# EAGLE design controllo motori - encoder_r3 (EAGLE 6.5.0)
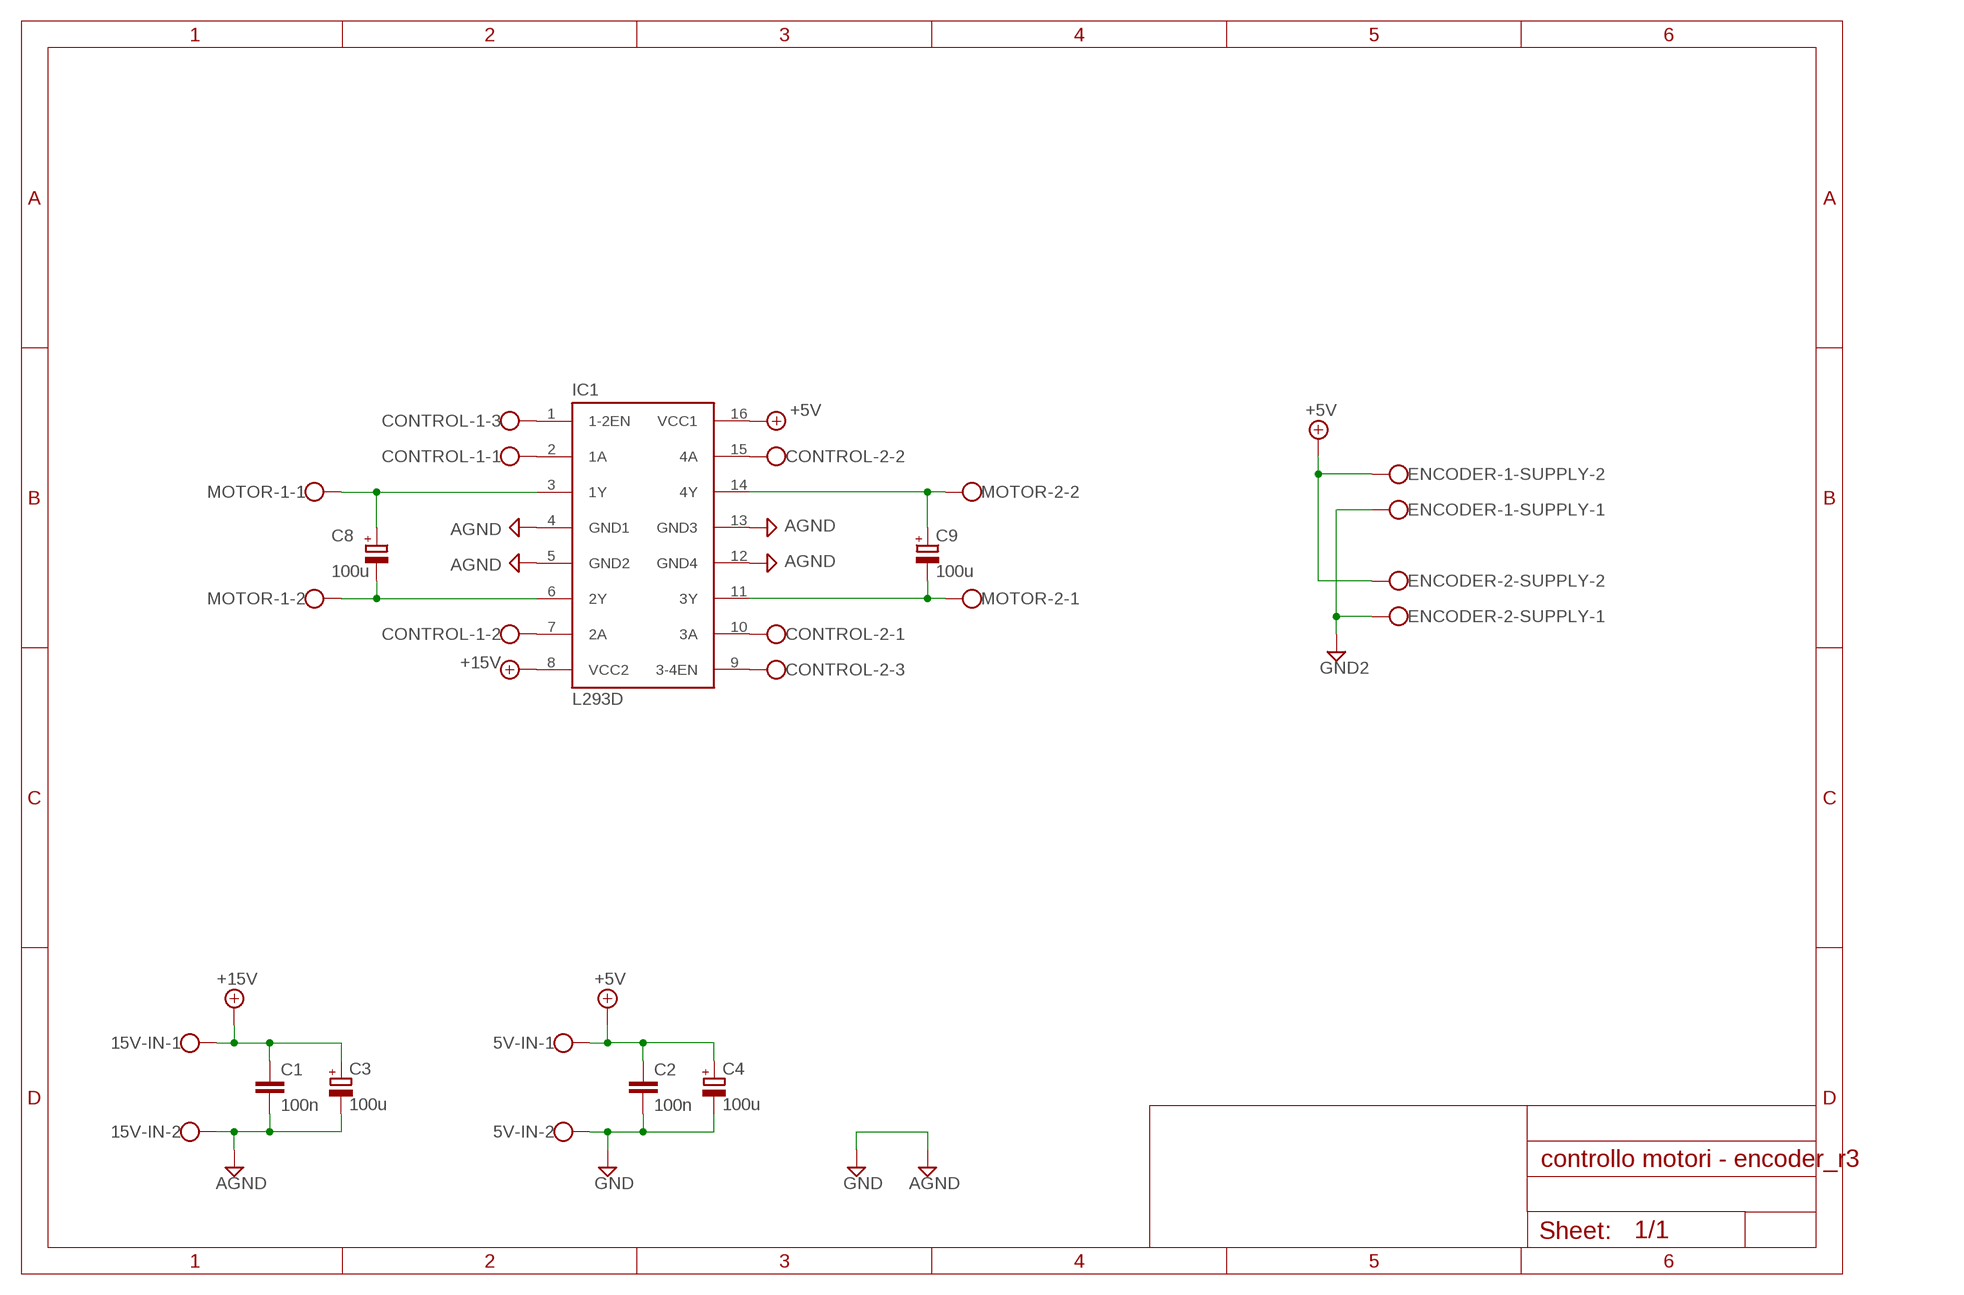
[diagram p0: schematic, sheet 1]

## Parts
5V-IN  W237-102  [W237-102]
15V-IN  W237-102  [W237-102]
C1  100n  C-EU025-025X050  [C025-025X050]
C2  100n  C-EU025-025X050  [C025-025X050]
C3  100u  CPOL-EUB45181B  [B45181B]
C4  100u  CPOL-EUB45181B  [B45181B]
C8  100u  CPOL-EUB45181B  [B45181B]
C9  100u  CPOL-EUB45181B  [B45181B]
CONTROL-1  W237-103  [W237-103]
CONTROL-2  W237-103  [W237-103]
ENCODER-1-SUPPLY  W237-102  [W237-102]
ENCODER-2-SUPPLY  W237-102  [W237-102]
IC1  L293D  [DIL16]
MOTOR-1  W237-102  [W237-102]
MOTOR-2  W237-102  [W237-102]

## Nets
+5V: 5V-IN.1 C2.1 C4.+ ENCODER-1-SUPPLY.2 ENCODER-2-SUPPLY.2 IC1.16(VCC1)
+15V: 15V-IN.1 C1.1 C3.+ IC1.8(VCC2)
AGND: 15V-IN.2 C1.2 C3.- IC1.4(GND1) IC1.5(GND2) IC1.12(GND4) IC1.13(GND3)
GND: 5V-IN.2 C2.2 C4.- ; supply symbol labelled AGND
GND2: ENCODER-1-SUPPLY.1 ENCODER-2-SUPPLY.1
N$1: C8.+ IC1.3(1Y) MOTOR-1.1
N$2: C8.- IC1.6(2Y) MOTOR-1.2
N$3: C9.- IC1.11(3Y) MOTOR-2.1
N$4: C9.+ IC1.14(4Y) MOTOR-2.2
N$5: CONTROL-1.1 IC1.2(1A)
N$6: CONTROL-1.2 IC1.7(2A)
N$7: CONTROL-1.3 IC1.1(1-2EN)
N$8: CONTROL-2.3 IC1.9(3-4EN)
N$9: CONTROL-2.1 IC1.10(3A)
N$10: CONTROL-2.2 IC1.15(4A)

## Library data of the parts
5V-IN 15V-IN ENCODER-1-SUPPLY ENCODER-2-SUPPLY MOTOR-1 MOTOR-2 = con-wago-500:W237-102: WAGO SCREW CLAMP; MPN: 237-102; OC_FARNELL: unknown; OC_NEWARK: 70K9898
C1 C2 = rcl:C-EU: CAPACITOR, European symbol
C3 C4 C8 C9 = rcl:CPOL-EU: POLARIZED CAPACITOR, European symbol
CONTROL-1 CONTROL-2 = con-wago-500:W237-103: WAGO SCREW CLAMP; MPN: 237-103; OC_FARNELL: unknown; OC_NEWARK: 18M7116
IC1 = st-microelectronics:L293D: PUSH-PULL 4 CHANNEL DRIVER; MPN: L293D; OC_FARNELL: 9589619; OC_NEWARK: 56P8249

## Board
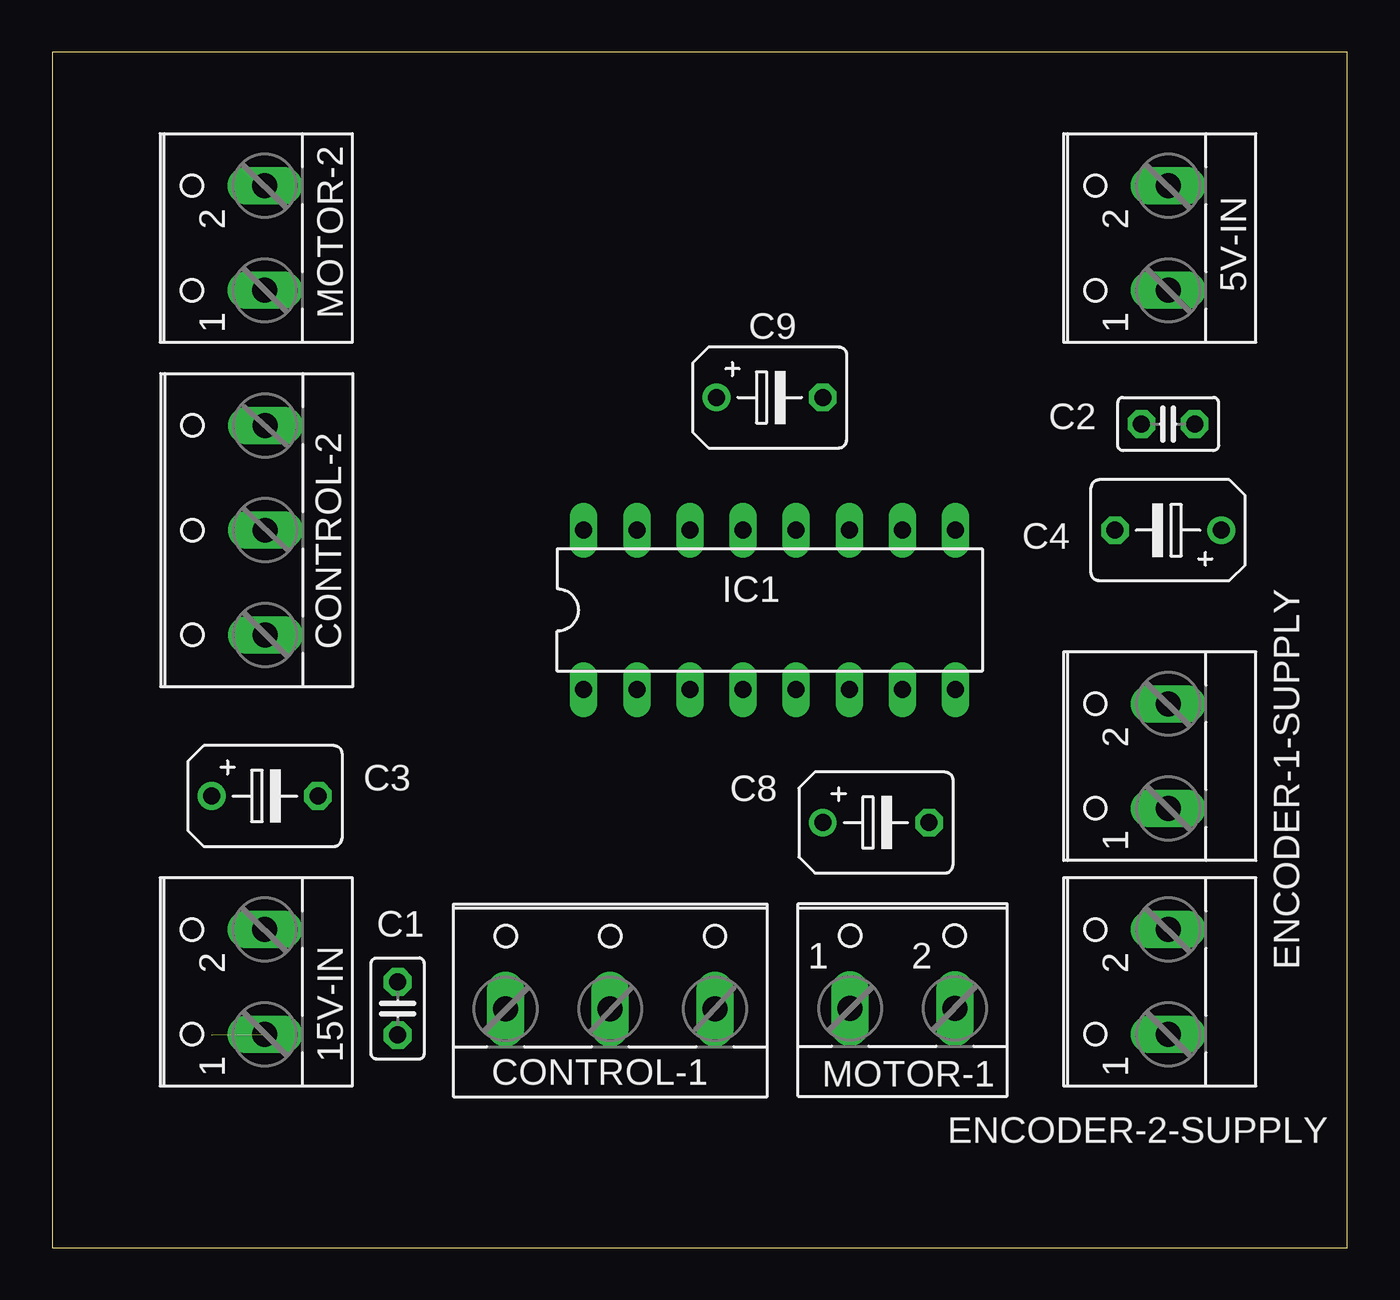
[diagram p1: board, top side]
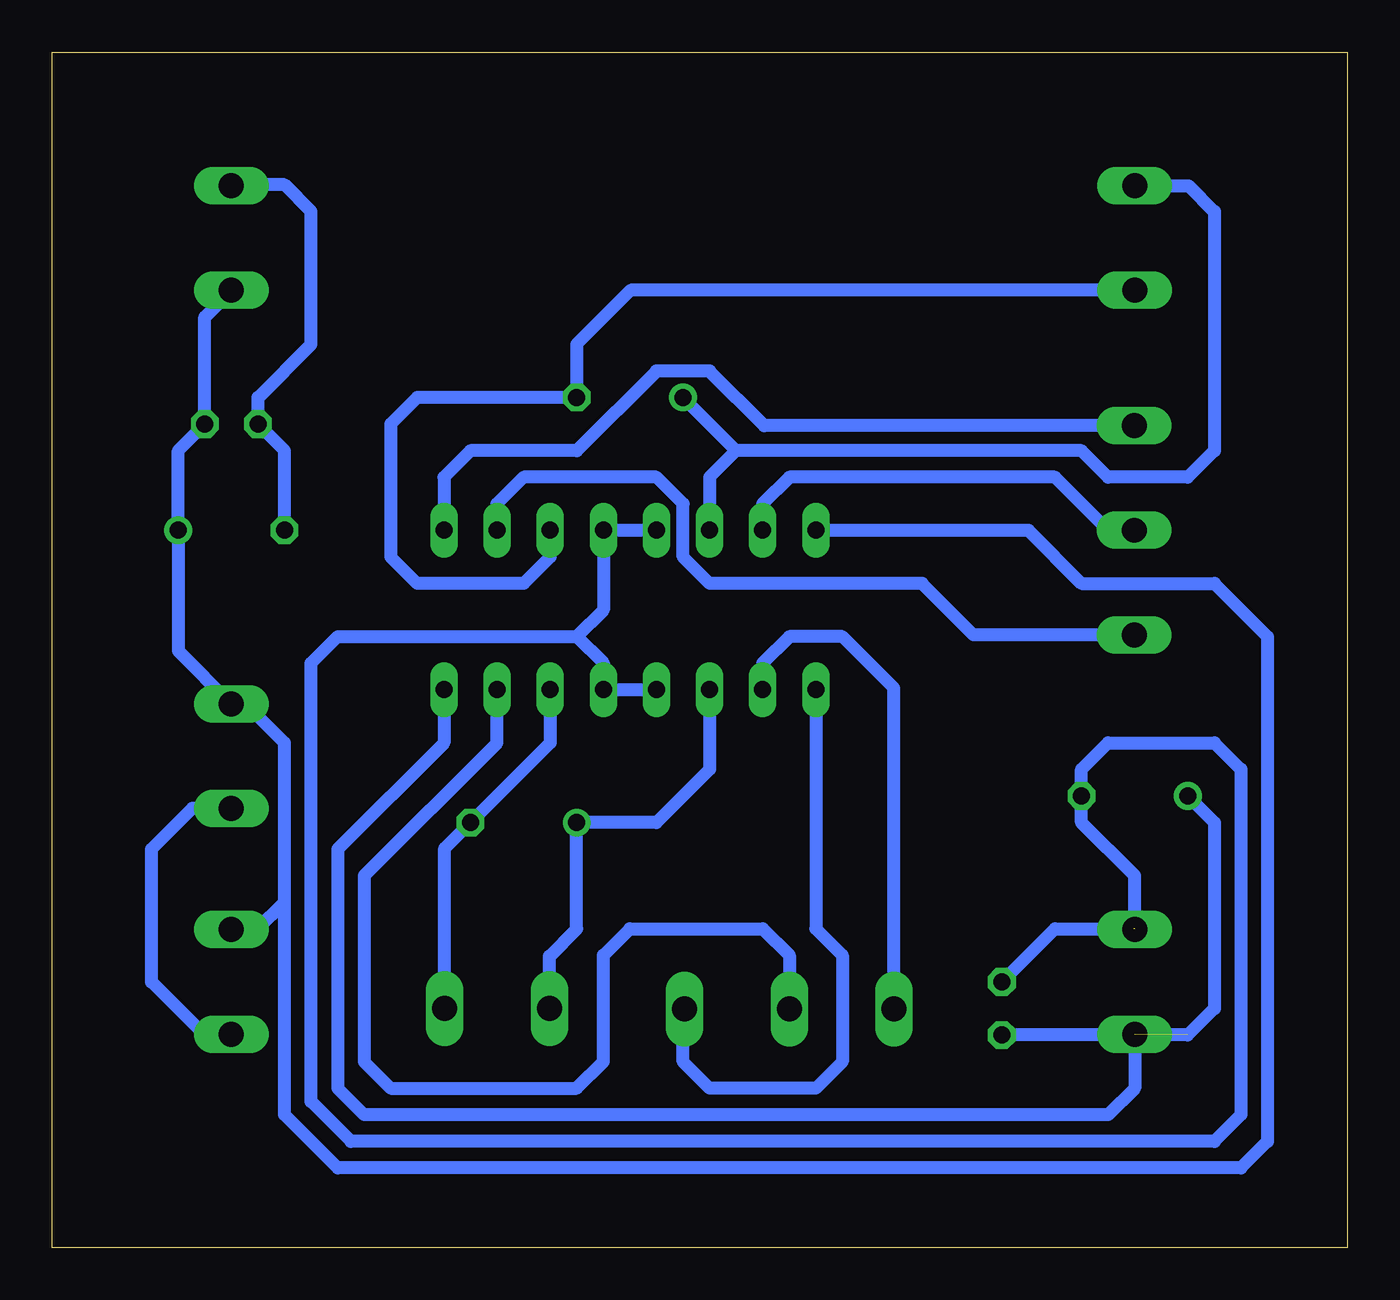
[diagram p2: board, bottom side, seen from below]

Size 61.9 x 57.14 mm. Coordinates in mm from the lower left corner, seen from the top.
Outline: 0,0 61.9,0 61.9,57.14 0,57.14 0,0
Copper layers (1*16): Top 0.035mm / dielectric 1.5mm / Bottom 0.035mm
Design rules "default": minimum track width 10mil, minimum drill 24mil, track to track 8mil, track to pad 8mil, pad to pad 8mil, via to via 8mil, smd to smd 8mil, copper to edge 40mil, drill to drill 8mil, minimum pad ring 10mil, minimum via ring 8mil, stop-mask expansion 4mil, vias tented up to drill 0mil, thermal gap 10mil

### Footprints (pad centres in the part's own frame; a part is rotated, then mirrored left to right if it is on the bottom)
W237-102 = drill 1.194 long: 1 -2.5,-1.27; 2 2.5,-1.27
C025-025X050 = drill 0.813 octagon: 1 -1.27,0; 2 1.27,0
B45181B = drill 0.813: + -2.54,0 | drill 0.813 octagon: - 2.54,0
W237-103 = drill 1.194 long: 1 -5,-1.29; 2 0,-1.29; 3 5,-1.29
DIL16 = drill 0.813 long: 1 -8.89,-3.81; 2 -6.35,-3.81; 3 -3.81,-3.81; 4 -1.27,-3.81; 5 1.27,-3.81; 6 3.81,-3.81; 7 6.35,-3.81; 8 8.89,-3.81; 9 8.89,3.81; 10 6.35,3.81; 11 3.81,3.81; 12 1.27,3.81; 13 -1.27,3.81; 14 -3.81,3.81; 15 -6.35,3.81; 16 -8.89,3.81

### Placement (x,y rotation side)
5V-IN  52.07,48.26 90 top
15V-IN  8.89,12.7 90 top
C1  16.51,11.43 90 top
C2  53.34,39.37 180 top
C3  10.16,21.59 0 top
C4  53.34,34.29 180 top
C8  39.37,20.32 0 top
C9  34.29,40.64 0 top
CONTROL-1  26.67,12.7 0 top
CONTROL-2  8.89,34.29 90 top
ENCODER-1-SUPPLY  52.07,23.5 90 top
ENCODER-2-SUPPLY  52.07,12.7 90 top
IC1  34.29,30.48 0 top
MOTOR-1  40.64,12.7 0 top
MOTOR-2  8.89,48.26 90 top

### Tracks (layer width: path | path; a pad name or v marks a point on that pad's centre or on a via)
+5V
  Bottom 0.61: IC1.16 15.24,34.29 12.7,31.75 6.35,31.75 3.81,29.21 3.81,5.08 5.08,3.81 48.26,3.81 50.8,6.35 50.8,16.51 | 50.8,16.51 50.8,24.13 52.66,26 ENCODER-1-SUPPLY.2 55.88,28.54 C4.+ 55.88,38.1 C2.1 54.61,44.49 5V-IN.1 | ENCODER-2-SUPPLY.2 52.11,15.2 50.8,16.51
+15V  (1 unrouted)
  Bottom 0.61: 15V-IN.1 10.16,7.62 11.43,6.35 46.99,6.35 48.26,7.62 48.26,19.05 43.18,24.13 IC1.8 | C3.+ 6.35,20.32 6.35,11.43 7.62,10.16 C1.1
AGND  (1 unrouted)
  Bottom 0.61: IC1.4 IC1.5 35.56,27.94 36.83,29.21 | IC1.13 IC1.12 35.56,30.48 36.83,29.21 | C1.2 13.97,15.24 10.2,15.24 15V-IN.2 | 10.16,15.24 10.16,17.78 12.7,20.32 C3.- 12.7,22.86 11.43,24.13 6.35,24.13 5.08,22.86 5.08,6.35 6.35,5.08 47.62,5.08 49.53,6.99 49.53,27.94 48.26,29.21 36.83,29.21
GND
  Bottom 0.61: C4.- 50.8,38.1 C2.2 52.07,40.64 49.53,43.18 49.53,49.53 50.8,50.8 53.3,50.8 5V-IN.2
GND2
  Bottom 0.61: ENCODER-2-SUPPLY.1 54.65,10.2 57.15,12.7 57.15,19.05 55.2,21 ENCODER-1-SUPPLY.1
N$1
  Bottom 0.61: MOTOR-1.1 38.14,13.93 36.83,15.24 C8.+ 33.02,20.32 30.48,22.86 IC1.3
N$2
  Bottom 0.61: MOTOR-1.2 43.14,19.09 C8.- 38.1,24.13 IC1.6
N$3
  Bottom 0.61: IC1.11 38.1,33.02 39.37,31.75 44.45,31.75 45.72,33.02 45.72,39.37 44.45,40.64 C9.- 36.83,43.18 34.25,45.76 MOTOR-2.1
N$4
  Bottom 0.61: IC1.14 30.48,36.83 29.21,38.1 | MOTOR-2.2 7.58,50.76 6.35,49.53 6.35,38.1 7.62,36.83 11.43,36.83 12.7,38.1 29.21,38.1 | C9.+ 29.21,38.1
N$5
  Bottom 0.61: CONTROL-1.1 21.67,26.75 24.13,29.21 26.67,29.21 27.94,27.94 IC1.2
N$6
  Bottom 0.61: CONTROL-1.2 26.67,13.97 27.94,15.24 34.29,15.24 35.56,13.97 35.56,8.89 36.83,7.62 45.72,7.62 46.99,8.89 46.99,17.78 40.64,24.13 IC1.7
N$7
  Bottom 0.61: IC1.1 25.4,15.24 24.13,13.97 24.13,8.89 25.4,7.62 30.48,7.62 31.75,8.89 31.75,11.33 CONTROL-1.3
N$8
  Bottom 0.61: CONTROL-2.3 27.86,39.29 30.48,41.91 33.02,41.91 36.83,38.1 41.91,38.1 43.18,36.83 IC1.9
N$9
  Bottom 0.61: CONTROL-2.1 17.86,29.29 20.32,31.75 30.48,31.75 31.75,33.02 31.75,35.56 33.02,36.83 39.37,36.83 40.64,35.56 IC1.10
N$10
  Bottom 0.61: CONTROL-2.2 11.43,34.29 13.97,36.83 26.67,36.83 27.94,35.56 IC1.15